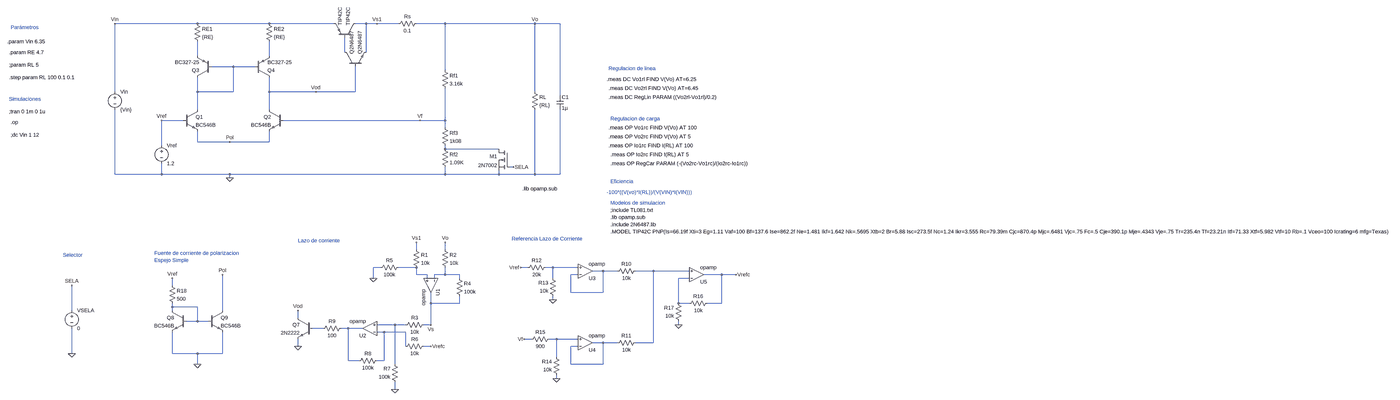
[diagram p0: schematic LDOB_Regulator_v1.asc, whole sheet]
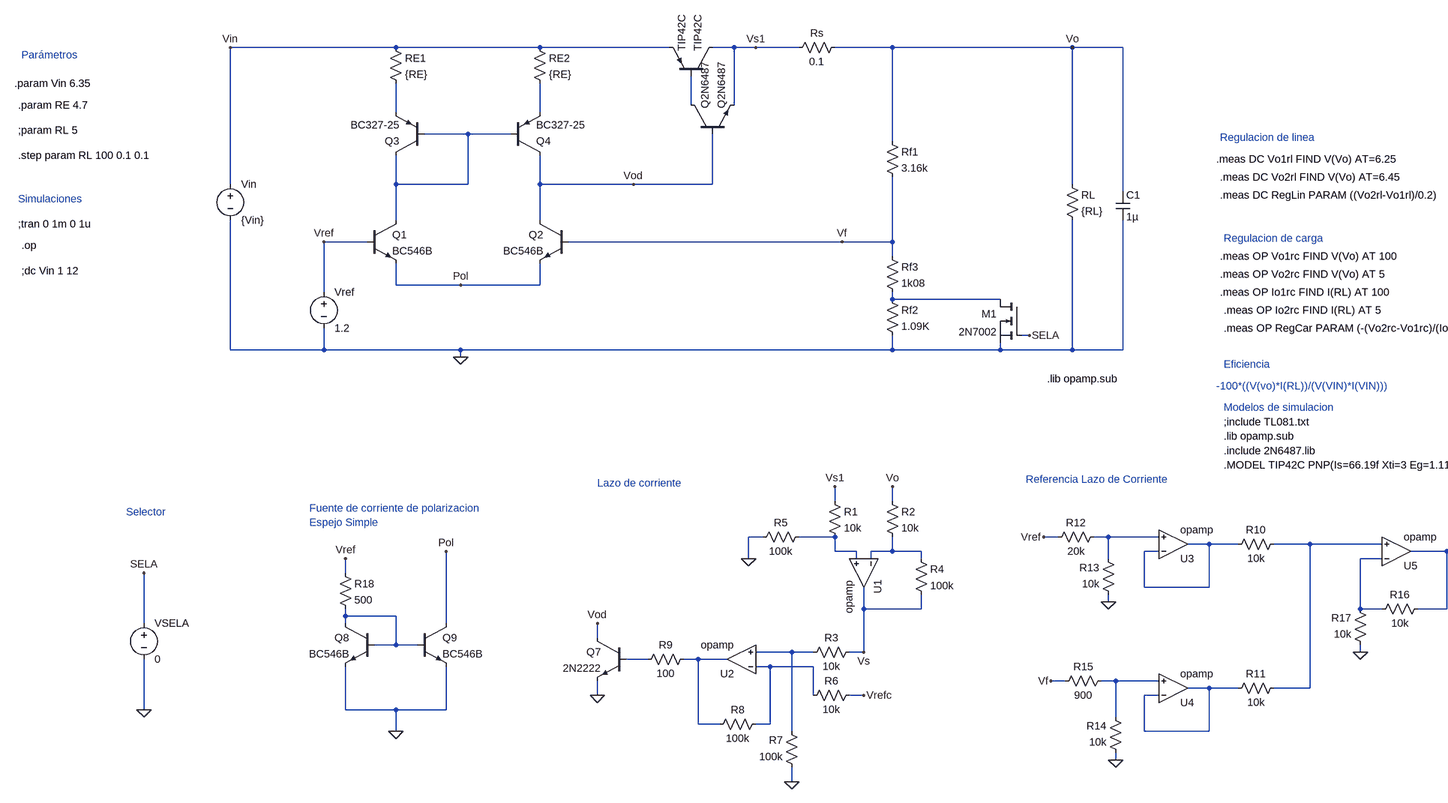
[diagram p1: schematic LDOB_Regulator_v1.asc, part, row 1 of 1, column 1 of 2]
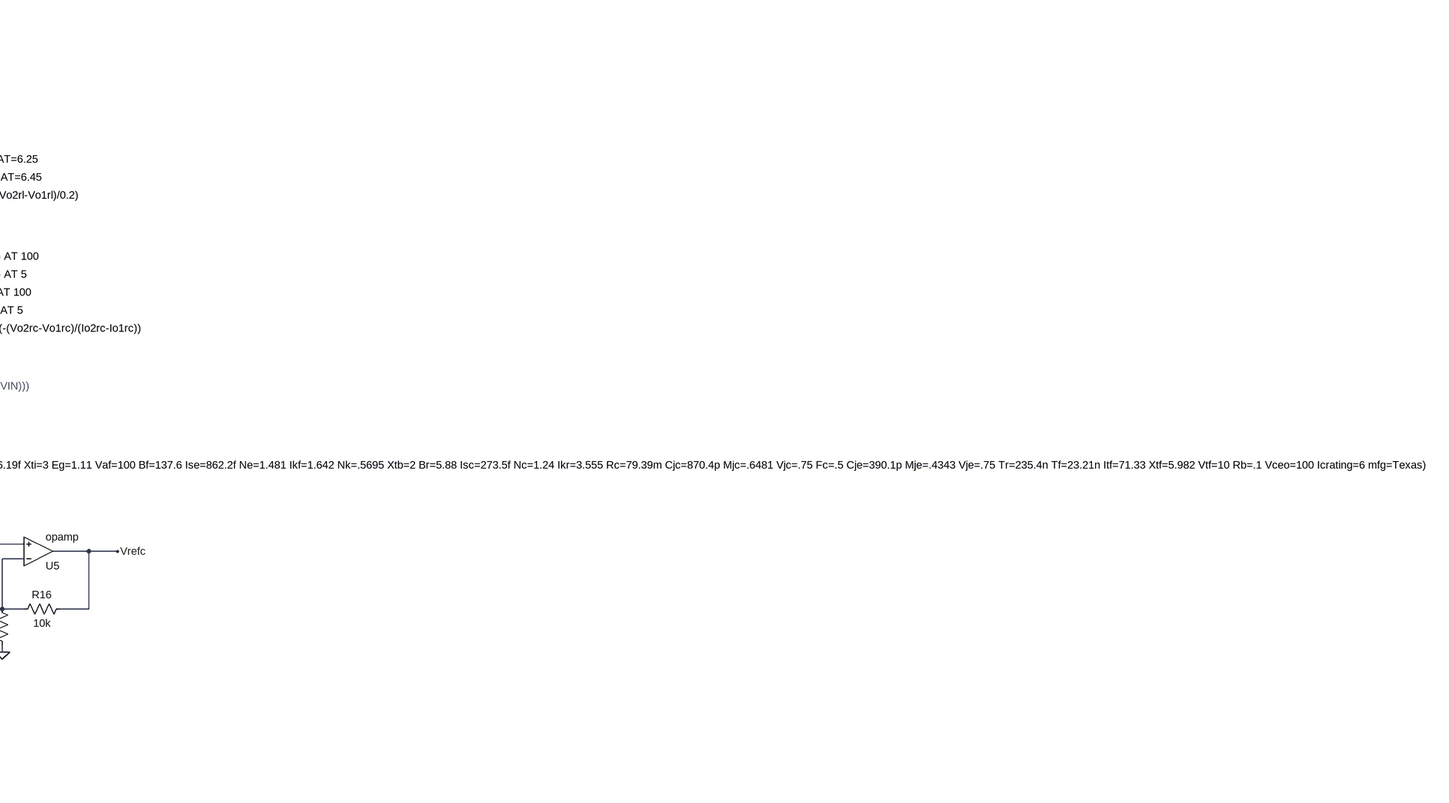
[diagram p2: schematic LDOB_Regulator_v1.asc, part, row 1 of 1, column 2 of 2]
LDOB_Regulator_v1.asc, the LTspice schematic file:
Version 4
SHEET 1 5200 1124
WIRE -496 -528 -864 -528
WIRE -176 -528 -496 -528
WIRE 112 -528 -176 -528
WIRE 256 -528 208 -528
WIRE 304 -528 256 -528
WIRE 400 -528 304 -528
WIRE 608 -528 480 -528
WIRE 1008 -528 608 -528
WIRE 1120 -528 1008 -528
WIRE 160 -400 160 -464
WIRE 256 -400 256 -528
WIRE -496 -384 -496 -448
WIRE -176 -384 -176 -448
WIRE -336 -336 -432 -336
WIRE -240 -336 -336 -336
WIRE 608 -320 608 -528
WIRE -864 -224 -864 -528
WIRE -496 -224 -496 -288
WIRE -336 -224 -336 -336
WIRE -336 -224 -496 -224
WIRE -176 -224 -176 -288
WIRE 32 -224 -176 -224
WIRE 208 -224 208 -336
WIRE 208 -224 32 -224
WIRE 1008 -224 1008 -528
WIRE 1120 -208 1120 -528
WIRE -496 -144 -496 -224
WIRE -176 -144 -176 -224
WIRE -560 -96 -656 -96
WIRE 496 -96 -112 -96
WIRE 608 -96 608 -240
WIRE 608 -96 496 -96
WIRE 608 -64 608 -96
WIRE -496 0 -496 -48
WIRE -352 0 -496 0
WIRE -176 0 -176 -48
WIRE -176 0 -352 0
WIRE -656 16 -656 -96
WIRE 608 32 608 16
WIRE 848 32 608 32
WIRE 912 112 896 112
WIRE -864 144 -864 -144
WIRE -656 144 -656 96
WIRE -656 144 -864 144
WIRE -352 144 -656 144
WIRE 608 144 608 112
WIRE 608 144 -352 144
WIRE 848 144 848 128
WIRE 848 144 608 144
WIRE 1008 144 1008 -144
WIRE 1008 144 848 144
WIRE 1120 144 1120 -144
WIRE 1120 144 1008 144
WIRE -352 160 -352 144
WIRE 480 480 480 448
WIRE 608 480 608 448
WIRE 320 560 288 560
WIRE 480 560 400 560
WIRE 976 560 944 560
WIRE 1088 560 1056 560
WIRE 1200 560 1088 560
WIRE 1312 576 1264 576
WIRE 1376 576 1312 576
WIRE 1536 576 1456 576
WIRE 1696 576 1536 576
WIRE 480 592 480 560
WIRE 528 592 480 592
WIRE 608 592 608 560
WIRE 608 592 560 592
WIRE 672 592 608 592
WIRE 1200 592 1168 592
WIRE 1840 592 1760 592
WIRE 1904 592 1840 592
WIRE 288 608 288 560
WIRE 528 608 528 592
WIRE 560 608 560 592
WIRE 672 608 672 592
WIRE 1088 608 1088 560
WIRE 1696 608 1648 608
WIRE -608 640 -608 608
WIRE 1168 672 1168 592
WIRE 1312 672 1312 576
WIRE 1312 672 1168 672
WIRE 1088 704 1088 688
WIRE 544 720 544 672
WIRE 672 720 672 688
WIRE 672 720 544 720
WIRE 1648 720 1648 608
WIRE 1696 720 1648 720
WIRE 1840 720 1840 592
WIRE 1840 720 1776 720
WIRE -608 736 -608 720
WIRE -496 736 -608 736
WIRE -1056 752 -1056 640
WIRE -608 752 -608 736
WIRE -384 752 -384 592
WIRE -48 784 -48 752
WIRE -496 800 -496 736
WIRE -496 800 -544 800
WIRE -448 800 -496 800
WIRE 384 816 304 816
WIRE 432 816 384 816
WIRE 544 816 544 720
WIRE 544 816 512 816
WIRE 1648 816 1648 800
WIRE 64 832 16 832
WIRE 176 832 144 832
WIRE 240 832 176 832
WIRE 336 848 304 848
WIRE 432 848 336 848
WIRE 992 880 960 880
WIRE 1104 880 1072 880
WIRE 1200 880 1104 880
WIRE 1312 896 1264 896
WIRE 1376 896 1312 896
WIRE 1536 896 1536 576
WIRE 1536 896 1456 896
WIRE -48 912 -48 880
WIRE 432 912 432 848
WIRE 544 912 512 912
WIRE 1200 912 1168 912
WIRE -1056 944 -1056 832
WIRE -608 944 -608 848
WIRE -496 944 -608 944
WIRE -384 944 -384 848
WIRE -384 944 -496 944
WIRE 1104 960 1104 880
WIRE 176 976 176 832
WIRE 224 976 176 976
WIRE 336 976 336 848
WIRE 336 976 304 976
WIRE -496 992 -496 944
WIRE 384 992 384 816
WIRE 1168 992 1168 912
WIRE 1312 992 1312 896
WIRE 1312 992 1168 992
WIRE 1104 1056 1104 1040
WIRE 384 1104 384 1072
FLAG -352 160 0
FLAG 912 112 SELA
FLAG -864 -528 Vin
FLAG 1008 -528 Vo
FLAG 32 -224 Vod
FLAG 496 -96 Vf
FLAG -656 -96 Vref
FLAG 304 -528 Vs1
FLAG 288 608 0
FLAG 384 1104 0
FLAG -48 912 0
FLAG -48 752 Vod
FLAG 544 816 Vs
FLAG 544 912 Vrefc
FLAG 480 448 Vs1
FLAG 608 448 Vo
FLAG 1088 704 0
FLAG 1104 1056 0
FLAG 1648 816 0
FLAG 944 560 Vref
FLAG 960 880 Vf
FLAG 1904 592 Vrefc
FLAG -1056 944 0
FLAG -1056 640 SELA
FLAG -384 592 Pol
FLAG -608 608 Vref
FLAG -496 992 0
FLAG -352 0 Pol
SYMBOL npn -560 -144 R0
SYMATTR InstName Q1
SYMATTR Value BC546B
SYMBOL npn -112 -144 M0
SYMATTR InstName Q2
SYMATTR Value BC546B
SYMBOL pnp -432 -288 R180
SYMATTR InstName Q3
SYMATTR Value BC327-25
SYMBOL pnp -240 -288 M180
SYMATTR InstName Q4
SYMATTR Value BC327-25
SYMBOL res -512 -544 R0
SYMATTR InstName RE1
SYMATTR Value {RE}
SYMBOL res -192 -544 R0
SYMATTR InstName RE2
SYMATTR Value {RE}
SYMBOL voltage -656 0 R0
WINDOW 123 0 0 Left 0
WINDOW 39 0 0 Left 0
SYMATTR InstName Vref
SYMATTR Value 1.2
SYMBOL pnp 208 -464 M270
SYMATTR InstName TIP42C
SYMATTR Value TIP42C
SYMBOL npn 160 -336 R270
SYMATTR InstName Q2N6487
SYMATTR Value Q2N6487
SYMBOL res 496 -544 R90
WINDOW 0 0 56 VBottom 2
WINDOW 3 32 56 VTop 2
SYMATTR InstName Rs
SYMATTR Value 0.1
SYMBOL res 592 -336 R0
SYMATTR InstName Rf1
SYMATTR Value 3.16k
SYMBOL res 592 -80 R0
SYMATTR InstName Rf3
SYMATTR Value 1k08
SYMBOL res 592 16 R0
SYMATTR InstName Rf2
SYMATTR Value 1.09K
SYMBOL res 992 -240 R0
SYMATTR InstName RL
SYMATTR Value {RL}
SYMBOL cap 1104 -208 R0
SYMATTR InstName C1
SYMATTR Value 1µ
SYMBOL voltage -864 -240 R0
SYMATTR InstName Vin
SYMATTR Value {Vin}
SYMBOL nmos 896 32 M0
SYMATTR InstName M1
SYMATTR Value 2N7002
SYMBOL res 464 464 R0
SYMATTR InstName R1
SYMATTR Value 10k
SYMBOL res 592 464 R0
SYMATTR InstName R2
SYMATTR Value 10k
SYMBOL res 528 800 R90
WINDOW 0 0 56 VBottom 2
WINDOW 3 32 56 VTop 2
SYMATTR InstName R3
SYMATTR Value 10k
SYMBOL res 656 592 R0
SYMATTR InstName R4
SYMATTR Value 100k
SYMBOL res 416 544 R90
WINDOW 0 0 56 VBottom 2
WINDOW 3 32 56 VTop 2
SYMATTR InstName R5
SYMATTR Value 100k
SYMBOL res 528 896 R90
WINDOW 0 0 56 VBottom 2
WINDOW 3 32 56 VTop 2
SYMATTR InstName R6
SYMATTR Value 10k
SYMBOL res 400 1088 R180
WINDOW 0 36 76 Left 2
WINDOW 3 36 40 Left 2
SYMATTR InstName R7
SYMATTR Value 100k
SYMBOL res 208 992 R270
WINDOW 0 32 56 VTop 2
WINDOW 3 0 56 VBottom 2
SYMATTR InstName R8
SYMATTR Value 100k
SYMBOL res 48 848 R270
WINDOW 0 32 56 VTop 2
WINDOW 3 0 56 VBottom 2
SYMATTR InstName R9
SYMATTR Value 100
SYMBOL npn 16 784 M0
SYMATTR InstName Q7
SYMATTR Value 2N2222
SYMBOL res 1472 560 R90
WINDOW 0 0 56 VBottom 2
WINDOW 3 32 56 VTop 2
SYMATTR InstName R10
SYMATTR Value 10k
SYMBOL res 1472 880 R90
WINDOW 0 0 56 VBottom 2
WINDOW 3 32 56 VTop 2
SYMATTR InstName R11
SYMATTR Value 10k
SYMBOL res 1072 544 R90
WINDOW 0 0 56 VBottom 2
WINDOW 3 32 56 VTop 2
SYMATTR InstName R12
SYMATTR Value 20k
SYMBOL res 1104 704 R180
WINDOW 0 36 76 Left 2
WINDOW 3 36 40 Left 2
SYMATTR InstName R13
SYMATTR Value 10k
SYMBOL res 1120 1056 R180
WINDOW 0 36 76 Left 2
WINDOW 3 36 40 Left 2
SYMATTR InstName R14
SYMATTR Value 10k
SYMBOL res 976 896 R270
WINDOW 0 32 56 VTop 2
WINDOW 3 0 56 VBottom 2
SYMATTR InstName R15
SYMATTR Value 900
SYMBOL res 1792 704 R90
WINDOW 0 0 56 VBottom 2
WINDOW 3 32 56 VTop 2
SYMATTR InstName R16
SYMATTR Value 10k
SYMBOL res 1664 816 R180
WINDOW 0 36 76 Left 2
WINDOW 3 36 40 Left 2
SYMATTR InstName R17
SYMATTR Value 10k
SYMBOL voltage -1056 736 R0
WINDOW 123 0 0 Left 0
WINDOW 39 0 0 Left 0
SYMATTR InstName VSELA
SYMATTR Value 0
SYMBOL OpAmps\\opamp 608 640 R90
SYMATTR InstName U1
SYMBOL OpAmps\\opamp 272 896 R180
SYMATTR InstName U2
SYMBOL OpAmps\\opamp 1232 640 M180
SYMATTR InstName U3
SYMBOL OpAmps\\opamp 1232 960 M180
SYMATTR InstName U4
SYMBOL OpAmps\\opamp 1728 656 M180
SYMATTR InstName U5
SYMBOL npn -544 752 M0
SYMATTR InstName Q8
SYMATTR Value BC546B
SYMBOL res -624 624 R0
SYMATTR InstName R18
SYMATTR Value 500
SYMBOL npn -448 752 R0
SYMATTR InstName Q9
SYMATTR Value BC546B
TEXT -1344 -448 Left 2 !.param Vin 6.35
TEXT -1328 -512 Left 2 ;Parámetros
TEXT -1336 -400 Left 2 !.param RE 4.7
TEXT -1336 -344 Left 2 !;param RL 5
TEXT -1336 -288 Left 2 !.step param RL 100 0.1 0.1
TEXT -48 440 Left 2 ;Lazo de corriente
TEXT 904 432 Left 2 ;Referencia Lazo de Corriente
TEXT -1336 -136 Left 2 !;tran 0 1m 0 1u
TEXT -1336 -192 Left 2 ;Simulaciones
TEXT -1328 -88 Left 2 !.op
TEXT -1328 -32 Left 2 !;dc Vin 1 12
TEXT 952 208 Left 2 !.lib opamp.sub
TEXT -688 496 Left 2 ;Fuente de corriente de polarizacion\nEspejo Simple
TEXT -1096 504 Left 2 ;Selector
TEXT 1328 -280 Left 2 !.meas DC Vo1rl FIND V(Vo) AT=6.25
TEXT 1336 -240 Left 2 !.meas DC Vo2rl FIND V(Vo) AT=6.45
TEXT 1336 -200 Left 2 !.meas DC RegLin PARAM ((Vo2rl-Vo1rl)/0.2)
TEXT 1336 -328 Left 2 ;Regulacion de linea
TEXT 1336 -64 Left 2 !.meas OP Vo1rc FIND V(Vo) AT 100
TEXT 1336 -24 Left 2 !.meas OP Vo2rc FIND V(Vo) AT 5
TEXT 1336 16 Left 2 !.meas OP Io1rc FIND I(RL) AT 100
TEXT 1344 56 Left 2 !.meas OP Io2rc FIND I(RL) AT 5
TEXT 1344 96 Left 2 !.meas OP RegCar PARAM (-(Vo2rc-Vo1rc)/(Io2rc-Io1rc))
TEXT 1344 -104 Left 2 ;Regulacion de carga
TEXT 1328 224 Left 2 ;-100*((V(vo)*I(RL))/(V(VIN)*I(VIN)))
TEXT 1344 176 Left 2 ;Eficiencia
TEXT 1344 304 Left 2 !;include TL081.txt
TEXT 1344 336 Left 2 !.lib opamp.sub
TEXT 1344 272 Left 2 ;Modelos de simulacion
TEXT 1344 368 Left 2 !.include 2N6487.lib
TEXT 1344 400 Left 2 !.MODEL TIP42C PNP(Is=66.19f Xti=3 Eg=1.11 Vaf=100 Bf=137.6 Ise=862.2f Ne=1.481 Ikf=1.642 Nk=.5695 Xtb=2 Br=5.88 Isc=273.5f Nc=1.24 Ikr=3.555 Rc=79.39m Cjc=870.4p Mjc=.6481 Vjc=.75 Fc=.5 Cje=390.1p Mje=.4343 Vje=.75 Tr=235.4n Tf=23.21n Itf=71.33 Xtf=5.982 Vtf=10 Rb=.1 Vceo=100 Icrating=6 mfg=Texas)

The netlist it stands for:
* LDOB_Regulator_v1.asc
Q1 N004 Vref Pol 0 BC546B
Q2 Vod Vf Pol 0 BC546B
Q3 N004 N004 N002 0 BC327-25
Q4 Vod N004 N003 0 BC327-25
RE1 Vin N002 {RE}
RE2 Vin N003 {RE}
Vref Vref 0 1.2
Q§TIP42C Vs1 N001 Vin 0 TIP42C
Q2N6487 N001 Vod Vs1 0 Q2N6487
Rs Vo Vs1 0.1
Rf1 Vo Vf 3.16k
Rf3 Vf N005 1k08
Rf2 N005 0 1.09K
RL Vo 0 {RL}
C1 Vo 0 1µ
Vin Vin 0 {Vin}
M1 N005 SELA 0 0 2N7002
R1 Vs1 N006 10k
R2 Vo N010 10k
R3 Vs N013 10k
R4 N010 Vs 100k
R5 N006 0 100k
R6 Vrefc N016 10k
R7 0 N013 100k
R8 N015 N016 100k
R9 N014 N015 100
Q7 Vod N014 0 0 2N2222
R10 N009 N008 10k
R11 N009 N018 10k
R12 N007 Vref 20k
R13 0 N007 10k
R14 0 N017 10k
R15 Vf N017 900
R16 Vrefc N011 10k
R17 0 N011 10k
VSELA SELA 0 0
XU1 N010 N006 Vs opamp Aol=100K GBW=10Meg  ; pins invin noninvin out
XU2 N016 N013 N015 opamp Aol=100K GBW=10Meg  ; pins invin noninvin out
XU3 N008 N007 N008 opamp Aol=100K GBW=10Meg  ; pins invin noninvin out
XU4 N018 N017 N018 opamp Aol=100K GBW=10Meg  ; pins invin noninvin out
XU5 N011 N009 Vrefc opamp Aol=100K GBW=10Meg  ; pins invin noninvin out
Q8 N012 N012 0 0 BC546B
R18 Vref N012 500
Q9 Pol N012 0 0 BC546B
.model NPN NPN
.model PNP PNP
.lib standard.bjt
.model NMOS NMOS
.model PMOS PMOS
.lib standard.mos
.param Vin 6.35
* Parámetros
.param RE 4.7
;param RL 5
.step param RL 100 0.1 0.1
* Lazo de corriente
* Referencia Lazo de Corriente
;tran 0 1m 0 1u
* Simulaciones
.op
;dc Vin 1 12
.lib opamp.sub
* Fuente de corriente de polarizacion
* Espejo Simple
* Selector
.meas DC Vo1rl FIND V(Vo) AT=6.25
.meas DC Vo2rl FIND V(Vo) AT=6.45
.meas DC RegLin PARAM ((Vo2rl-Vo1rl)/0.2)
* Regulacion de linea
.meas OP Vo1rc FIND V(Vo) AT 100
.meas OP Vo2rc FIND V(Vo) AT 5
.meas OP Io1rc FIND I(RL) AT 100
.meas OP Io2rc FIND I(RL) AT 5
.meas OP RegCar PARAM (-(Vo2rc-Vo1rc)/(Io2rc-Io1rc))
* Regulacion de carga
* -100*((V(vo)*I(RL))/(V(VIN)*I(VIN)))
* Eficiencia
;include TL081.txt
.lib opamp.sub
* Modelos de simulacion
.include 2N6487.lib
.MODEL TIP42C PNP(Is=66.19f Xti=3 Eg=1.11 Vaf=100 Bf=137.6 Ise=862.2f Ne=1.481 Ikf=1.642 Nk=.5695 Xtb=2 Br=5.88 Isc=273.5f Nc=1.24 Ikr=3.555 Rc=79.39m Cjc=870.4p Mjc=.6481 Vjc=.75 Fc=.5 Cje=390.1p Mje=.4343 Vje=.75 Tr=235.4n Tf=23.21n Itf=71.33 Xtf=5.982 Vtf=10 Rb=.1 Vceo=100 Icrating=6 mfg=Texas)
.backanno
.end